# Altium schematic sheet Common_Mode_Filter.SchDoc: Common Mode Filter
size A4; CompanyName: -; DrawnBy: Naldi, López; Revision: 1; SheetNumber: 3; SheetTotal: 4; Number: 25
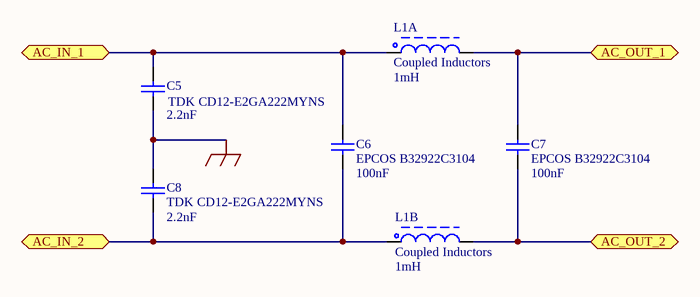
[diagram p0: Common_Mode_Filter.SchDoc]

## Parts
C5  TDK CD12-E2GA222MYNS  value 2.2nF  [SAFETY Y1 type]
C6  EPCOS B32922C3104  value 100nF  [MKP PITCH:15mm SIZE:5mmx18mm]
C7  EPCOS B32922C3104  value 100nF  [MKP PITCH:15mm SIZE:5mmx18mm]
C8  TDK CD12-E2GA222MYNS  value 2.2nF  [SAFETY Y1 type]
L1  Coupled Inductors  value 1mH  [Bourns 8108-RC]  (parts A,B of 2)

## Ports
AC_IN_1 (bidir), AC_IN_2 (bidir), AC_OUT_1 (bidir), AC_OUT_2 (bidir)

## Nets
EARTH: C5.1 C8.1
AC_IN_1: C5.2 C6.2 L1.1 ; port AC_IN_1
AC_IN_2: C6.1 C8.2 L1.4 ; port AC_IN_2
AC_OUT_1: C7.2 L1.2 ; port AC_OUT_1
AC_OUT_2: C7.1 L1.3 ; port AC_OUT_2

## Notes on the sheet
- Title
- Size:
- Project:
- A4
- Number:
- Revision:
- Sheet
- of
- Drawn by:
- Company:
- File:

## Library data of the parts
C5 C8 = TDK CD12-E2GA222MYNS: Safety Standard Certified Ceramic Y1 2.2nF 250Vac; Published: 8-Jun-2000; LatestRevisionDate: 17-Jul-2002; LatestRevisionNote: Re-released for DXP Platform.; PackageReference: RAD-0.3; Publisher: Altium Limited; PackageDescription: Radial Cap, Thru-Hole; 2 Leads; 0.3 in Pin Spacing
C6 C7 = EPCOS B32922C3104: MKP EMI suppression X2 100nF 305Vac; Published: 8-Jun-2000; LatestRevisionDate: 17-Jul-2002; LatestRevisionNote: Re-released for DXP Platform.; PackageReference: RAD-0.3; Publisher: Altium Limited; PackageDescription: Radial Cap, Thru-Hole; 2 Leads; 0.3 in Pin Spacing
L1 = Common mode filter 10A: Bourns Common mode inductor 10A 1mH 8108-RC; Code_IEC: 1005; Published: 8-Jun-2000; LatestRevisionDate: 29-May-2009; LatestRevisionNote: IPC-7351 Footprint Added.; PackageReference: 0402-A; Publisher: Altium Limited; PackageDescription: Chip Inductor; Code_JEITA: 0402